# EAGLE design Sheild Generator - Main unit (EAGLE 6.4)
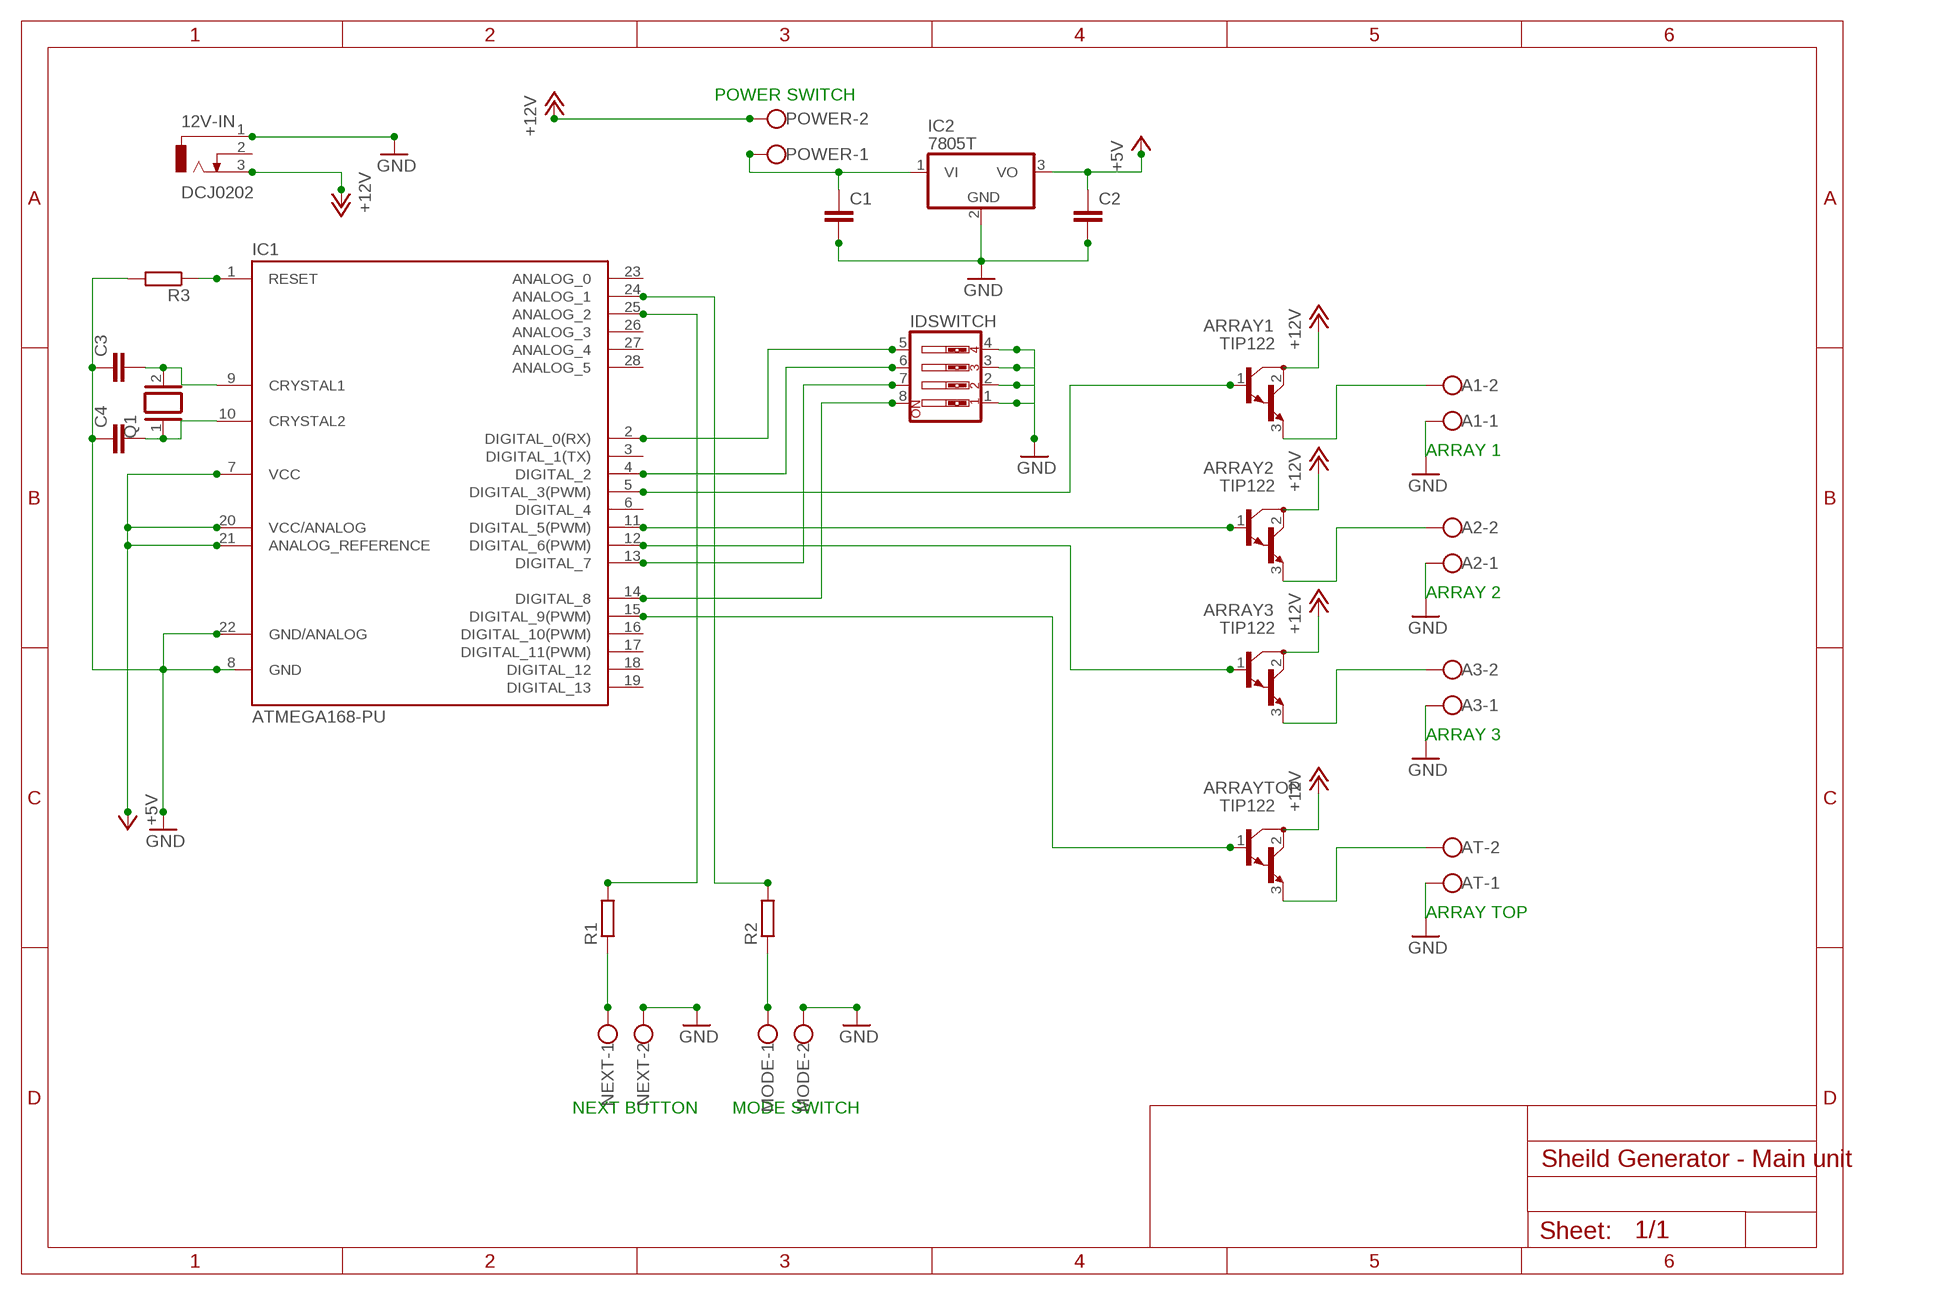
[diagram p0: schematic, sheet 1]

## Parts
12V-IN  DCJ0202  [DCJ0202]
A1  W237-102  [W237-102]
A2  W237-102  [W237-102]
A3  W237-102  [W237-102]
ARRAY1  TIP122  [TO220]
ARRAY2  TIP122  [TO220]
ARRAY3  TIP122  [TO220]
ARRAYTOP  TIP122  [TO220]
AT  W237-102  [W237-102]
C1  C-EU025-024X044  [C025-024X044]
C2  C-EU025-024X044  [C025-024X044]
C3  C-EU025-024X044  [C025-024X044]
C4  C-EU025-024X044  [C025-024X044]
IC1  ATMEGA168-PU  [DIL28-3]
IC2  7805T  [TO220H]
IDSWITCH  SW_DIP-4  [EDG-04]
MODE  W237-102  [W237-102]
NEXT  W237-102  [W237-102]
POWER  W237-102  [W237-102]
Q1  XTAL/S  [QS]
R1  R-EU_0204/7  [0204/7]
R2  R-EU_0204/7  [0204/7]
R3  R-EU_0204/7  [0204/7]

## Nets
+5V: C2.1 IC1.7(VCC) IC1.20(VCC/ANALOG) IC1.21(ANALOG_REFERENCE) IC2.3(VO)
+12V: 12V-IN.3 ARRAY1.2(C) ARRAY2.2(C) ARRAY3.2(C) ARRAYTOP.2(C) POWER.2
GND: 12V-IN.1 A1.1 A2.1 A3.1 AT.1 C1.2 C2.2 C3.1 C4.1 IC1.8(GND) IC1.22(GND/ANALOG) IC2.2(GND) IDSWITCH.1 IDSWITCH.2 IDSWITCH.3 IDSWITCH.4 MODE.2 NEXT.2 R3.2
N$1: ARRAY1.1(B) IC1.5(DIGITAL_3(PWM))
N$2: ARRAY2.1(B) IC1.11(DIGITAL_5(PWM))
N$3: ARRAY3.1(B) IC1.12(DIGITAL_6(PWM))
N$4: ARRAYTOP.1(B) IC1.15(DIGITAL_9(PWM))
N$5: IC1.2(DIGITAL_0(RX)) IDSWITCH.5
N$6: IC1.4(DIGITAL_2) IDSWITCH.6
N$7: IC1.13(DIGITAL_7) IDSWITCH.7
N$8: IC1.14(DIGITAL_8) IDSWITCH.8
N$9: NEXT.1 R1.1
N$10: IC1.25(ANALOG_2) R1.2
N$11: A1.2 ARRAY1.3(E)
N$12: A2.2 ARRAY2.3(E)
N$13: A3.2 ARRAY3.3(E)
N$14: ARRAYTOP.3(E) AT.2
N$15: IC1.24(ANALOG_1) R2.2
N$16: MODE.1 R2.1
N$17: C3.2 IC1.9(CRYSTAL1) Q1.2
N$18: C1.1 IC2.1(VI) POWER.1
N$19: C4.2 IC1.10(CRYSTAL2) Q1.1
N$21: IC1.1(RESET) R3.1
Unconnected: 12V-IN.2 IC1.3(DIGITAL_1(TX)) IC1.6(DIGITAL_4) IC1.16(DIGITAL_10(PWM)) IC1.17(DIGITAL_11(PWM)) IC1.18(DIGITAL_12) IC1.19(DIGITAL_13) IC1.23(ANALOG_0) IC1.26(ANALOG_3) IC1.27(ANALOG_4) IC1.28(ANALOG_5)

## Notes on the sheet
- POWER SWITCH
- ARRAY 1
- ARRAY 2
- ARRAY 3
- ARRAY TOP
- NEXT BUTTON | MODE SWITCH

## Library data of the parts
12V-IN = con-jack:DCJ0202: DC POWER JACK Source: DCJ0202.pdf; OC_FARNELL: unknown; OC_NEWARK: unknown
A1-A3 AT MODE NEXT POWER = con-wago-500:W237-102: WAGO SCREW CLAMP; MPN: 237-102; OC_FARNELL: unknown; OC_NEWARK: 70K9898
ARRAY1-ARRAY3 ARRAYTOP = transistor:TIP122: NPN BIPOLAR DARLINGTON TRANSISTOR
C1-C4 = rcl:C-EU: CAPACITOR, European symbol
IC1 = Arduino-AVR:ATMEGA168-PU
IC2 = adafruit:78*: Positive VOLTAGE REGULATOR Added bigger pads to the TO-92 package
IDSWITCH = special:SW_DIP-4: DIP SWITCH
Q1 = special:XTAL/S: CRYSTAL
R1-R3 = resistor:R-EU_: RESISTOR, European symbol

## Net classes
1 GND: width 2.032 mm, drill 2.032 mm, clearance 2.032 mm
2 +12V: width 4.064 mm, drill 4.064 mm, clearance 4.064 mm

## Board
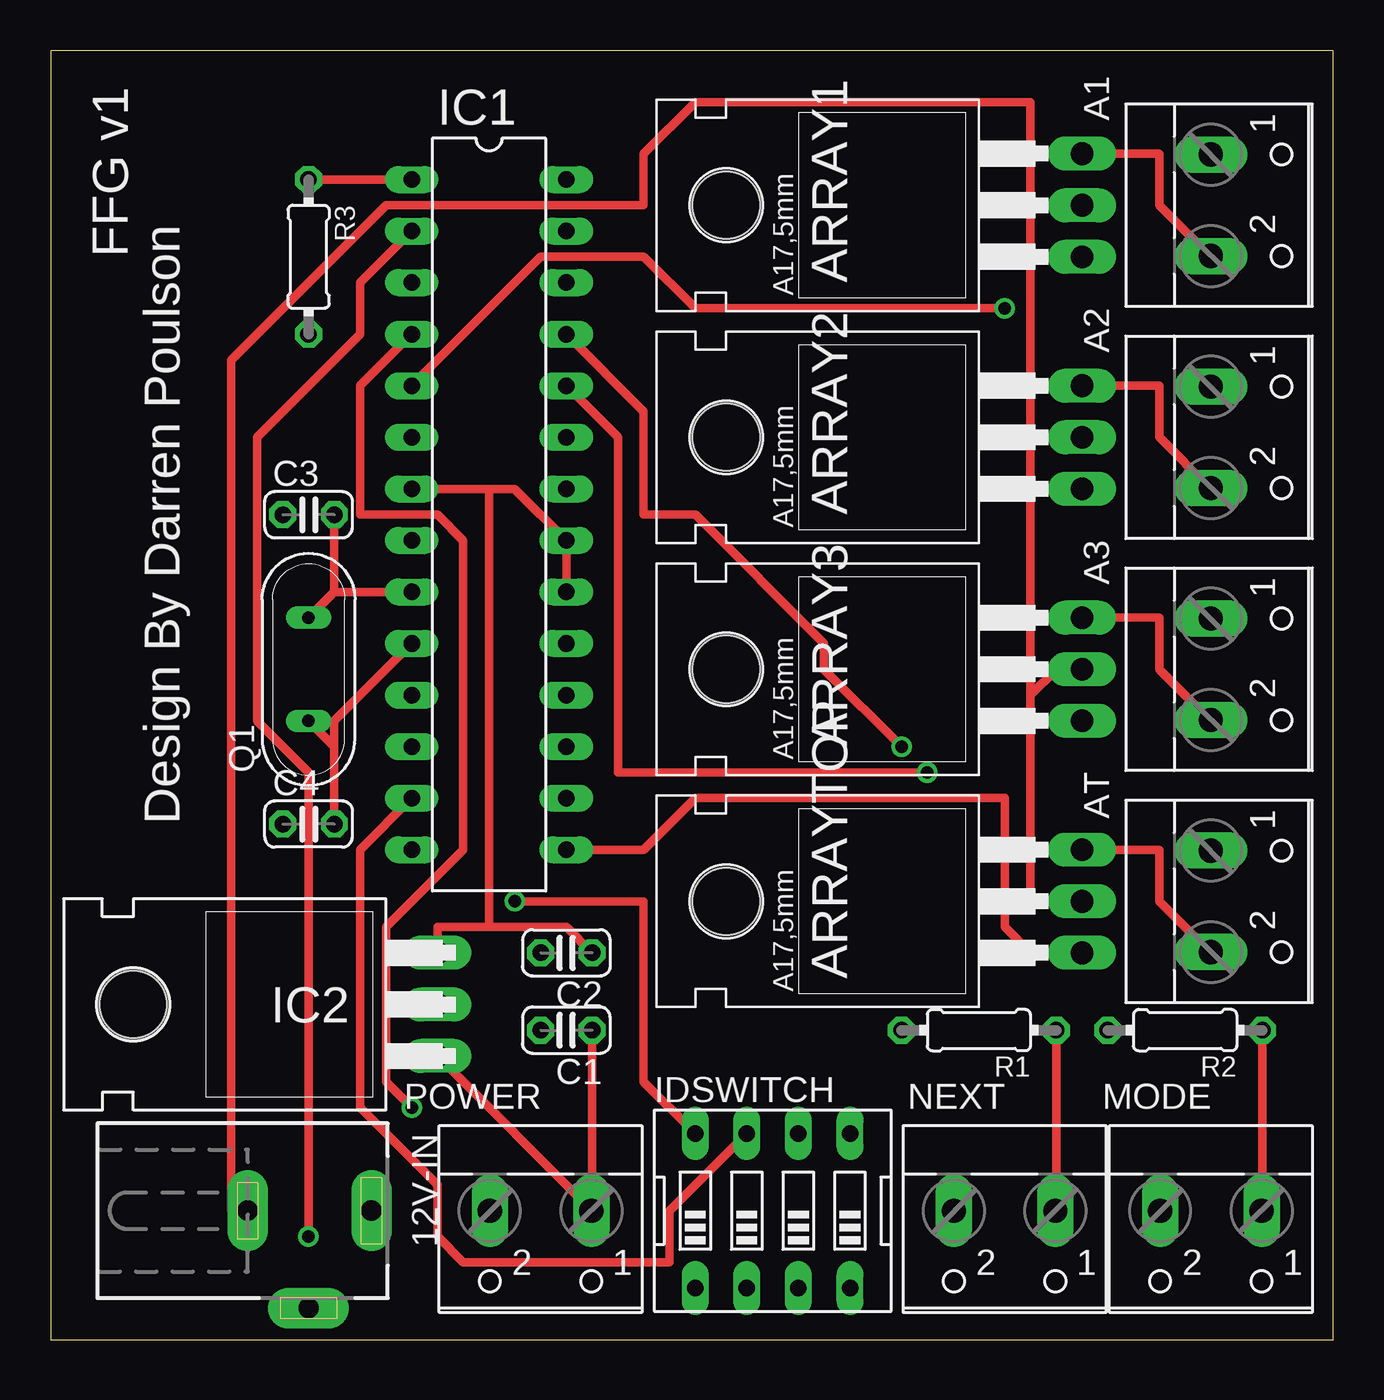
[diagram p1: board, top side]
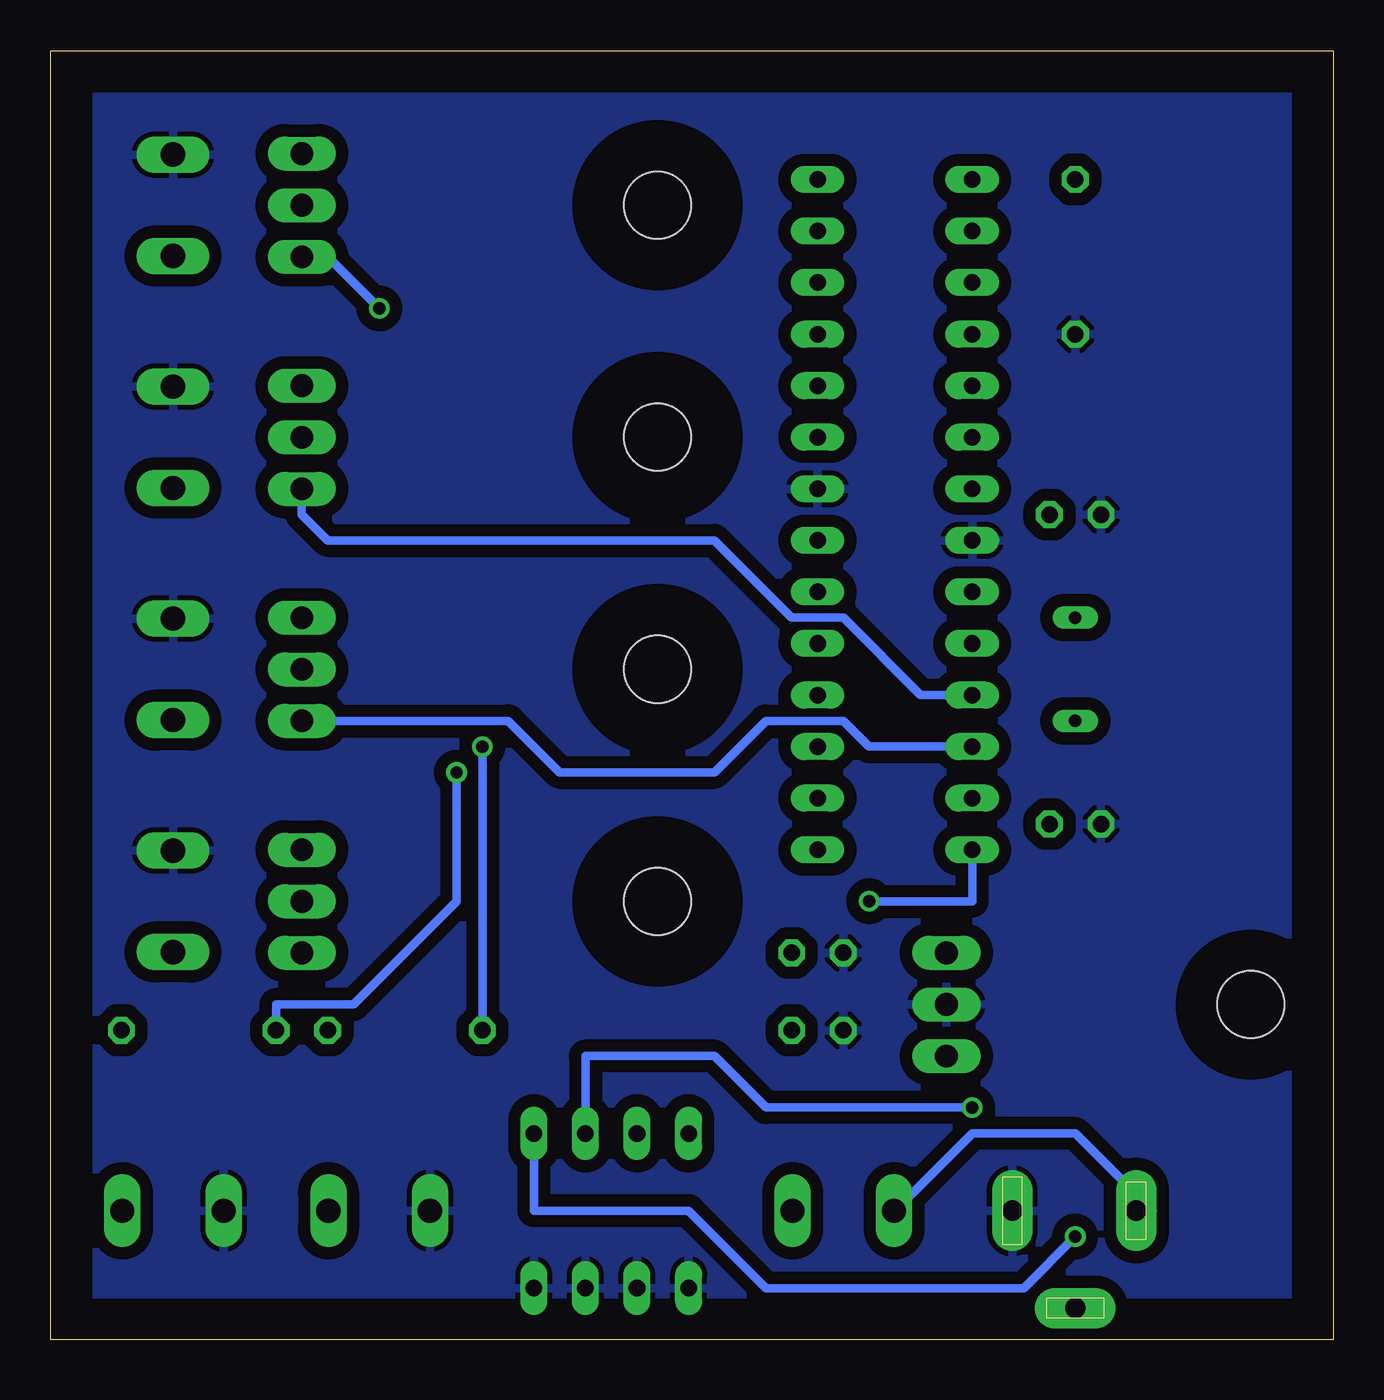
[diagram p2: board, bottom side, seen from below]

Size 63.17 x 63.49 mm. Coordinates in mm from the lower left corner, seen from the top.
Outline: 0,0 63.17,0 63.17,63.49 0,63.49 0,0
Copper layers (1*16): Top 0.035mm / dielectric 1.5mm / Bottom 0.035mm
Design rules "default *": minimum track width 16mil, minimum drill 24mil, track to track 24mil, track to pad 16mil, pad to pad 16mil, via to via 16mil, smd to smd 16mil, copper to edge 80mil, drill to drill 8mil, minimum pad ring 10mil, minimum via ring 8mil, stop-mask expansion 4mil, vias tented up to drill 0mil, thermal gap 10mil

### Footprints (pad centres in the part's own frame; a part is rotated, then mirrored left to right if it is on the bottom)
DCJ0202 = drill 1 pad 2 long: 1 0,3.1; 2 4.8,0; 3 0,-3
W237-102 = drill 1.194 long: 1 -2.5,-1.27; 2 2.5,-1.27
TO220 = drill 1.118 long: 1 -2.54,-6.35; 2 0,-6.35; 3 2.54,-6.35 | hole 3.302: 0,11.176
C025-024X044 = drill 0.813 octagon: 1 -1.27,0; 2 1.27,0
DIL28-3 = drill 0.813 long: 1 -16.51,-3.81; 2 -13.97,-3.81; 3 -11.43,-3.81; 4 -8.89,-3.81; 5 -6.35,-3.81; 6 -3.81,-3.81; 7 -1.27,-3.81; 8 1.27,-3.81; 9 3.81,-3.81; 10 6.35,-3.81; 11 8.89,-3.81; 12 11.43,-3.81; 13 13.97,-3.81; 14 16.51,-3.81; 15 16.51,3.81; 16 13.97,3.81; 17 11.43,3.81; 18 8.89,3.81; 19 6.35,3.81; 20 3.81,3.81; 21 1.27,3.81; 22 -1.27,3.81; 23 -3.81,3.81; 24 -6.35,3.81; 25 -8.89,3.81; 26 -11.43,3.81; 27 -13.97,3.81; 28 -16.51,3.81
TO220H = drill 1.118 long: 1 -2.54,-10.16; 2 0,-10.16; 3 2.54,-10.16 | hole 3.302: 0,4.826
EDG-04 = drill 0.813 long: 1 -3.81,-3.81; 2 -1.27,-3.81; 3 1.27,-3.81; 4 3.81,-3.81; 5 3.81,3.81; 6 1.27,3.81; 7 -1.27,3.81; 8 -3.81,3.81
QS = drill 0.61 long: 1 -2.54,0; 2 2.54,0
0204/7 = drill 0.813 octagon: 1 -3.81,0; 2 3.81,0

### Placement (x,y rotation side)
12V-IN  12.7,6.35 270 top
A1  58.42,55.88 270 top
A2  58.42,44.45 270 top
A3  58.42,33.02 270 top
ARRAY1  44.45,55.88 90 top
ARRAY2  44.45,44.45 90 top
ARRAY3  44.45,33.02 90 top
ARRAYTOP  44.45,21.59 90 top
AT  58.42,21.59 270 top
C1  25.4,15.24 180 top
C2  25.4,19.05 180 top
C3  12.7,40.64 0 top
C4  12.7,25.4 0 top
IC1  21.59,40.64 270 top
IC2  8.89,16.51 90 top
IDSWITCH  35.56,6.35 0 top
MODE  57.15,5.08 180 top
NEXT  46.99,5.08 180 top
POWER  24.13,5.08 180 top
Q1  12.7,33.02 90 top
R1  45.72,15.24 180 top
R2  55.88,15.24 180 top
R3  12.7,53.34 270 top

### Tracks (layer width: path | path; a pad name or v marks a point on that pad's centre or on a via)
+5V
  Top 0.406: C2.1 25.4,20.32 21.59,20.32 | 21.59,20.32 19.05,20.32 IC2.3 | IC1.20 IC1.21 22.86,41.91 21.59,41.91 | 21.59,41.91 IC1.7 | 21.59,41.91 21.59,20.32
+12V
  Top 0.406: ARRAYTOP.2 48.26,21.59 48.26,31.75 | 48.26,31.75 49.53,33.02 ARRAY3.2 | 48.26,44.45 ARRAY2.2 | 48.26,31.75 48.26,44.45 | 48.26,55.88 ARRAY1.2 | 48.26,44.45 48.26,55.88 | 48.26,55.88 48.26,60.96 31.75,60.96 29.21,58.42 29.21,55.88 16.51,55.88 8.89,48.26 8.89,6.35 12V-IN.3
  Bottom 0.406: POWER.2 21.59,6.35 17.78,10.16 12.7,10.16 8.89,6.35 12V-IN.3
GND
  pour Bottom: 1.27,62.23 62.23,62.23 62.23,1.27 1.27,1.27
N$1  (via drill 0.61)
  Top 0.406: IC1.5 24.13,53.34 29.21,53.34 31.75,50.8 v46.99,50.8
  Bottom 0.406: v46.99,50.8 49.53,53.34 ARRAY1.1
N$2
  Bottom 0.406: IC1.11 20.32,31.75 24.13,35.56 26.67,35.56 30.48,39.37 49.53,39.37 50.8,40.64 ARRAY2.1
N$3
  Bottom 0.406: IC1.12 22.86,29.21 24.13,30.48 27.94,30.48 30.48,27.94 38.1,27.94 40.64,30.48 ARRAY3.1
N$4
  Top 0.406: IC1.15 29.21,24.13 31.75,26.67 46.99,26.67 46.99,20.32 48.26,19.05 ARRAYTOP.1
N$5  (via drill 0.61)
  Top 0.406: v12.7,5.08 12.7,27.94 10.16,30.48 10.16,44.45 15.24,49.53 15.24,52.07 IC1.2
  Bottom 0.406: IDSWITCH.5 39.37,6.35 31.75,6.35 27.94,2.54 15.24,2.54 v12.7,5.08
N$6  (via drill 0.61)
  Top 0.406: v17.78,11.43 16.51,12.7 16.51,20.32 20.32,24.13 20.32,39.37 19.05,40.64 15.24,40.64 15.24,46.99 IC1.4
  Bottom 0.406: IDSWITCH.6 36.83,13.97 30.48,13.97 27.94,11.43 v17.78,11.43
N$7
  Top 0.406: IC1.13 15.24,24.13 15.24,11.43 19.05,7.62 19.05,5.08 20.32,3.81 30.48,3.81 30.48,6.35 IDSWITCH.7
N$8  (via drill 0.61)
  Top 0.406: v22.86,21.59 29.21,21.59 29.21,12.7 IDSWITCH.8
  Bottom 0.406: IC1.14 17.78,21.59 v22.86,21.59
N$9
  Top 0.406: R1.1 49.53,6.35 NEXT.1
N$10  (via drill 0.61)
  Top 0.406: v41.91,29.21 38.1,33.02 38.1,34.29 31.75,40.64 29.21,40.64 29.21,45.72 IC1.25
  Bottom 0.406: v41.91,29.21 R1.2
N$11
  Top 0.406: ARRAY1.3 54.61,58.42 54.61,55.88 57.15,53.34 A1.2
N$12
  Top 0.406: ARRAY2.3 54.61,46.99 54.61,44.45 57.15,41.91 A2.2
N$13
  Top 0.406: ARRAY3.3 54.61,35.56 54.61,33.02 57.15,30.48 A3.2
N$14
  Top 0.406: ARRAYTOP.3 54.61,24.13 54.61,21.59 57.15,19.05 AT.2
N$15  (via drill 0.61)
  Top 0.406: v43.18,27.94 27.94,27.94 27.94,44.45 IC1.24
  Bottom 0.406: R2.2 52.07,16.51 48.26,16.51 43.18,21.59 v43.18,27.94
N$16
  Top 0.406: R2.1 59.69,6.35 MODE.1
N$17
  Top 0.406: 13.97,36.83 Q1.2 | C3.2 13.97,36.83 | 13.97,36.83 IC1.9
N$18
  Top 0.406: 26.67,6.35 C1.1 | 26.67,6.35 IC2.1 | 26.67,6.35 POWER.1
N$19
  Top 0.406: 13.97,29.21 Q1.1 | C4.2 13.97,29.21 | IC1.10 13.97,30.48 13.97,29.21
N$21
  Top 0.406: IC1.1 R3.1

### Text on the board
tNames: FFG v1 | Design By Darren Poulson